# EAGLE design brick_i2c_mpu9250 (EAGLE 7.2.0)
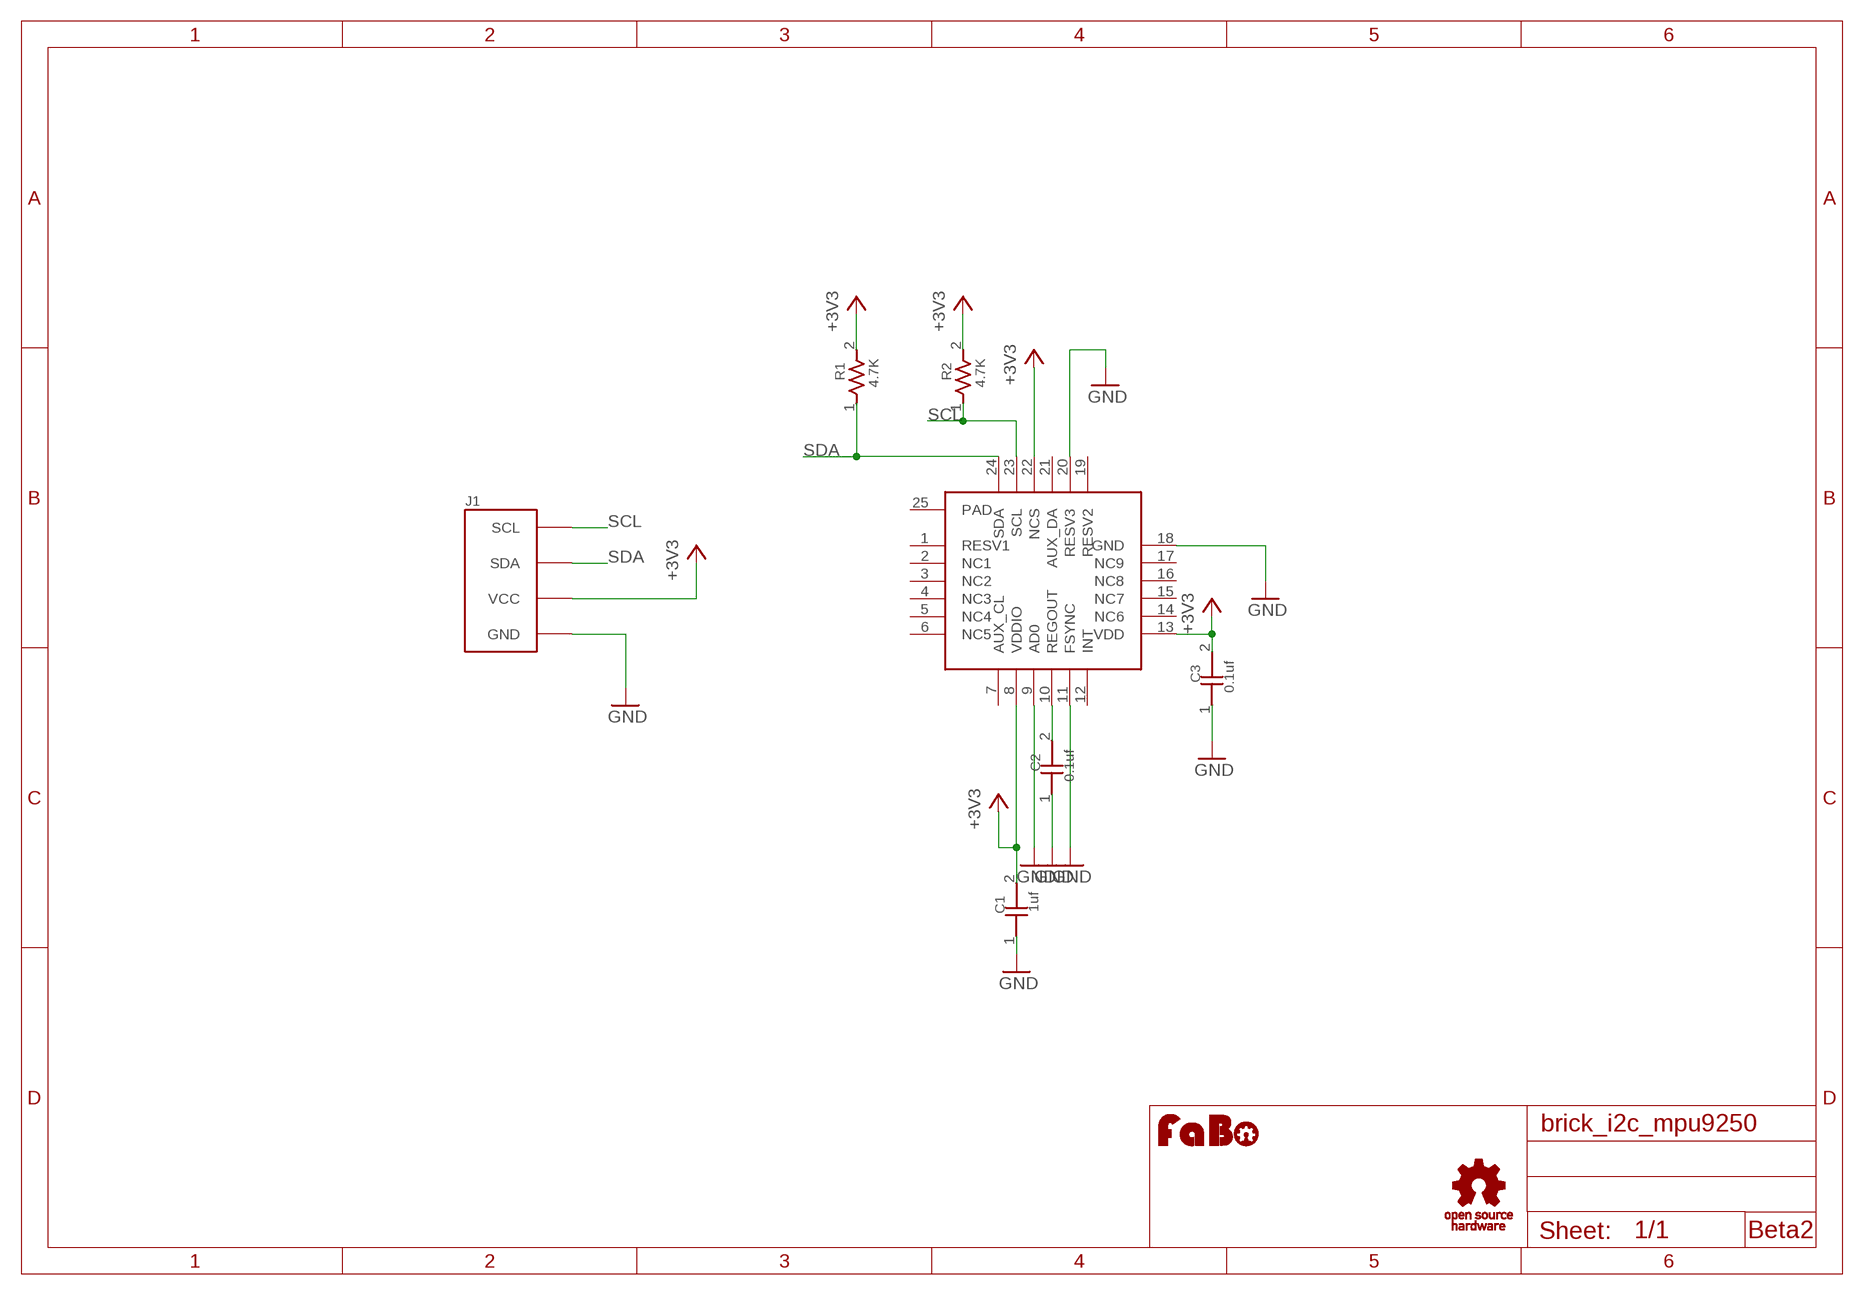
[diagram p0: schematic, sheet 1]

## Parts
C1  1uf  CAPACITOR0603  [0603]
C2  0.1uf  CAPACITOR0603  [0603]
C3  0.1uf  CAPACITOR0603  [0603]
J1  BRICK_I2C  [BRICK_I2C]
R1  4.7K  RESISTOR0603  [0603]
R2  4.7K  RESISTOR0603  [0603]
U$1  INVENSENSE-MPU9250  [LGA-24]
U$3  LOGO_FABO-M  [LOGO_FABO_M]
U$5  LOGO_OSHW_T-M  [LOGO_OSHW_T_M]

## Nets
+3V3: C1.2 C3.2 J1.VCC R1.2 R2.2 U$1.8(VDDIO) U$1.13(VDD) U$1.22(NCS)
GND: C1.1 C2.1 C3.1 J1.GND U$1.9(AD0) U$1.11(FSYNC) U$1.18(GND) U$1.20(RESV3)
N$3: C2.2 U$1.10(REGOUT)
SCL: J1.SCL R2.1 U$1.23(SCL)
SDA: J1.SDA R1.1 U$1.24(SDA)
Unconnected: U$1.1(RESV1) U$1.2(NC1) U$1.3(NC2) U$1.4(NC3) U$1.5(NC4) U$1.6(NC5) U$1.7(AUX_CL) U$1.12(INT) U$1.14(NC6) U$1.15(NC7) U$1.16(NC8) U$1.17(NC9) U$1.19(RESV2) U$1.21(AUX_DA) U$1.25(PAD)

## Notes on the sheet
- Beta2

## Library data of the parts
C1-C3 = GClue-Capacitor:CAPACITOR
J1 = gclue:BRICK_I2C: FaBo Brick 4pin(I2C)
R1 R2 = GClue-Resistors:RESISTOR
U$1 = GClue-Mems:INVENSENSE-MPU9250
U$3 = FaBo:LOGO_FABO
U$5 = gclue:LOGO_OSHW_T

## Board
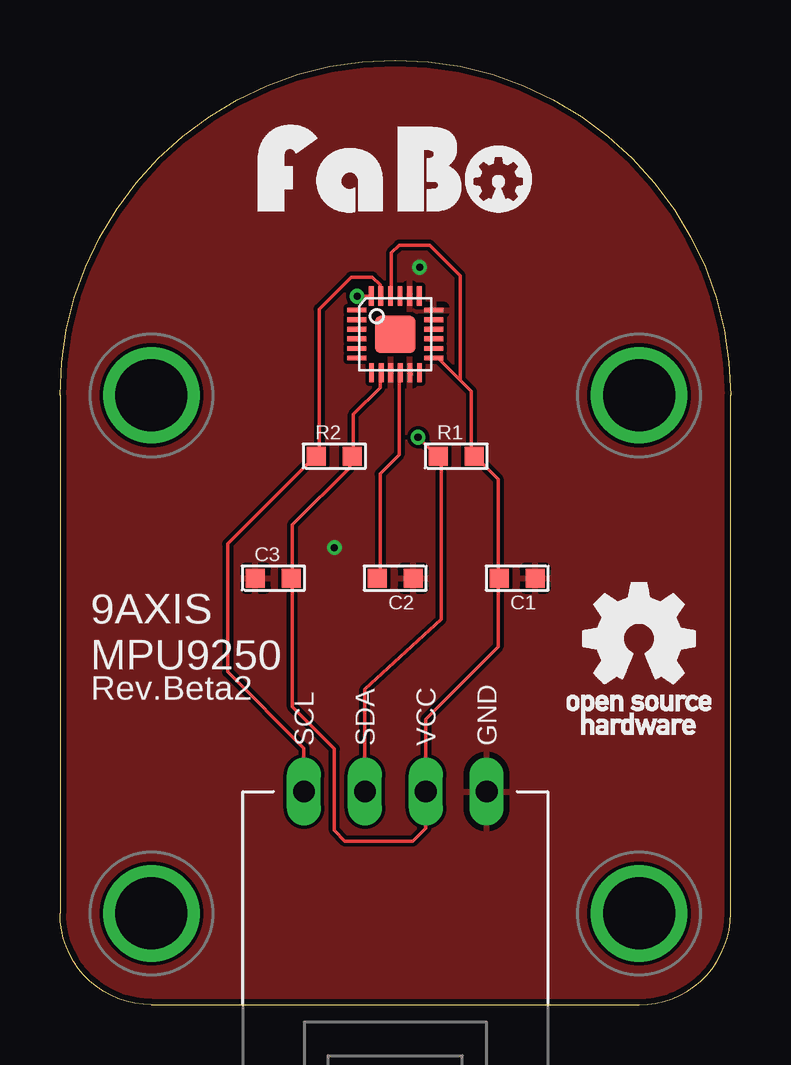
[diagram p1: board, top side]
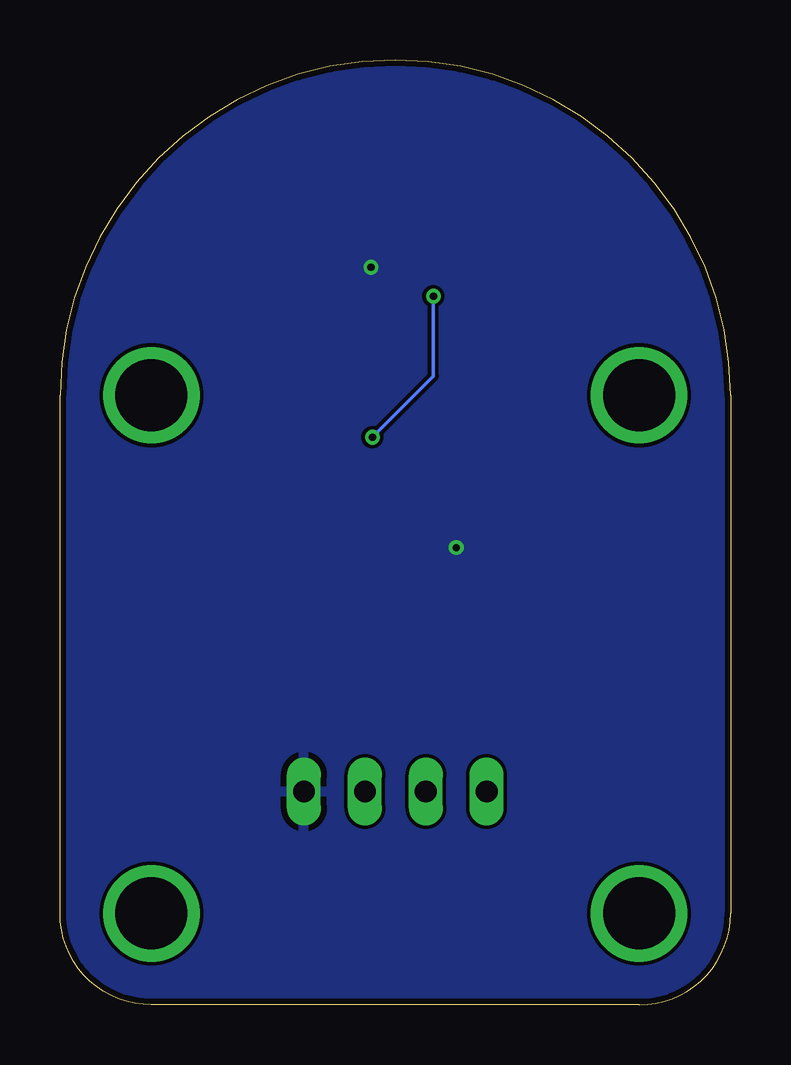
[diagram p2: board, bottom side, seen from below]

Size 27.94 x 39.37 mm. Coordinates in mm from the lower left corner, seen from the top.
Copper layers (1*16): Top 0.035mm / dielectric 1.5mm / Bottom 0.035mm
Design rules "Elecrow_2-layer_eagle_rule": minimum track width 6mil, minimum drill 12mil, track to track 6mil, track to pad 6mil, pad to pad 6mil, via to via 6mil, smd to smd 0mil, copper to edge 10mil, drill to drill 10mil, minimum pad ring 10mil, minimum via ring 6mil, stop-mask expansion 2mil, vias tented up to drill 100mil, thermal gap 10mil

### Footprints (pad centres in the part's own frame; a part is rotated, then mirrored left to right if it is on the bottom)
0603 = smd 0.8 x 0.8: 1 -0.75,0; 2 0.75,0
BRICK_I2C = drill 0.9 long: GND 3.81,-10.16; SCL -3.81,-10.16; SDA -1.27,-10.16; VCC 1.27,-10.16 | drill 3 pad 3.81: P$1 -10.16,6.35; P$2 10.16,6.35; P$3 -10.16,-15.24; P$4 10.16,-15.24
LGA-24 = smd 0.8 x 0.2: 1 -1.6,1.01; 2 -1.6,0.61; 3 -1.6,0.21; 4 -1.6,-0.19; 5 -1.6,-0.59; 6 -1.6,-0.99; 13 1.6,-0.99; 14 1.6,-0.59; 15 1.6,-0.19; 16 1.6,0.21; 17 1.6,0.61; 18 1.6,1.01 | smd 0.2 x 0.8: 7 -0.99,-1.6; 8 -0.59,-1.6; 9 -0.19,-1.6; 10 0.21,-1.6; 11 0.61,-1.6; 12 1.01,-1.6; 19 1,1.6; 20 0.6,1.6; 21 0.2,1.6; 22 -0.2,1.6; 23 -0.6,1.6; 24 -1,1.6 | smd 1.7 x 1.55: 25 0,0

### Placement (x,y rotation side)
C1  19.05,17.78 180 top
C2  13.97,17.78 180 top
C3  8.89,17.78 0 top
J1  13.97,19.05 0 top
R1  16.51,22.86 0 top
R2  11.43,22.86 0 top
U$1  13.97,27.94 0 top
U$3  13.97,33.02 0 top
U$5  24.13,15.24 0 top

### Tracks (layer width: path | path; a pad name or v marks a point on that pad's centre or on a via)
+3V3
  Top 0.152: 9.68,17.78 9.68,20 12.06,22.38 12.06,22.86 R2.2 12.22,22.86 12.22,24.61 13.34,25.72 13.34,26.19 U$1.8 | 16.67,26.04 15.72,26.99 U$1.13 | 16.67,26.04 17.14,25.56 17.14,22.86 R1.2 17.3,22.86 18.26,21.91 18.26,17.78 | 16.67,26.04 16.67,30.39 15.4,31.66 14.13,31.66 13.81,31.34 13.81,29.69 U$1.22 | 18.26,17.78 18.26,14.92 15.24,11.91 J1.VCC 15.24,7.37 14.7,6.83 11.87,6.83 11.43,7.27 11.43,10.67 9.68,12.41 9.68,17.78 | 18.26,17.78 C1.2 | 9.68,17.78 C3.2
GND  (via drill 0.3)
  other vias: 11.43,19.05 14.99,30.73
  pour Bottom: -1.27,-1.27 29.21,-1.27 29.21,40.64 -1.27,40.64
  pour Top: -1.27,-1.27 29.21,-1.27 29.21,40.64 -1.27,40.64
N$3
  Top 0.152: C2.2 13.34,17.78 13.34,22.13 14.13,22.92 14.13,26.19 U$1.10
SCL
  Top 0.152: U$1.23 13.34,29.69 13.34,30 13.02,30.32 12.13,30.32 10.79,28.99 10.79,22.86 R2.1 10.64,22.86 6.99,19.21 6.99,13.88 10.16,10.7 J1.SCL
SDA  (via drill 0.3)
  Top 0.152: J1.SDA 12.7,13.14 15.88,16.07 15.88,22.86 R1.1 15.72,22.86 v14.92,23.65 | v12.38,29.53 13.02,29.53 U$1.24
  Bottom 0.152: v12.38,29.53 12.38,26.19 v14.92,23.65

### Text on the board
tPlace: 9AXIS / MPU9250 | Rev.Beta2